# Altium project PCB_Project1.PrjPCB
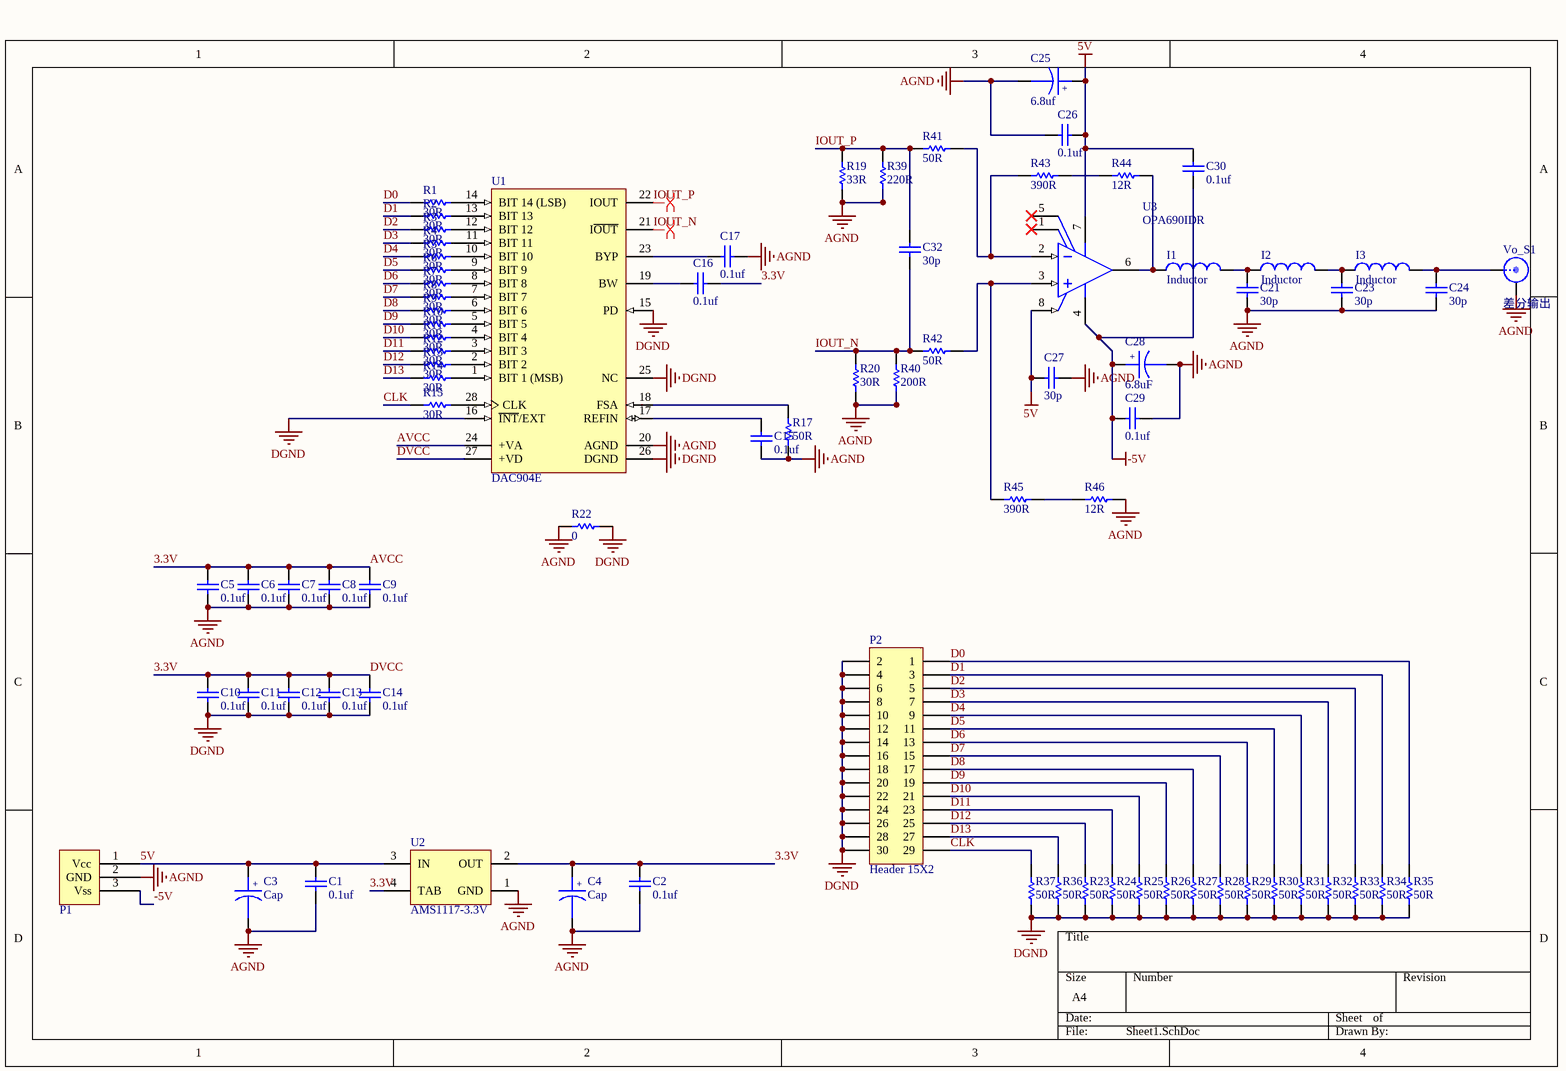
[diagram p0: Sheet1.SchDoc]
1 sheet, 78 parts. Net scope: global (net labels, ports and power ports of the same name join across sheets).
Board files: PCB1.PcbDoc, PCB2.PcbDoc

## Sheet Sheet1.SchDoc
size A4

### Parts
C1  0.1uf  [0805]
C2  0.1uf  [0805]
C3  Cap  [7343C-TYPE_D]
C4  Cap  [7343C-TYPE_D]
C5  0.1uf  [0603C]
C6  0.1uf  [0603C]
C7  0.1uf  [0603C]
C8  0.1uf  [0603C]
C9  0.1uf  [0603C]
C10  0.1uf  [0603C]
C11  0.1uf  [0603C]
C12  0.1uf  [0603C]
C13  0.1uf  [0603C]
C14  0.1uf  [0603C]
C15  0.1uf  [0603C]
C16  0.1uf  [0603C]
C17  0.1uf  [0603C]
C21  30p  [0603C]
C23  30p  [0603C]
C24  30p  [0603C]
C25  6.8uf  [3216C-TYPE_A]
C26  0.1uf  [0603C]
C27  30p  [0603C]
C28  6.8uF  [3216C-TYPE_A]
C29  0.1uf  [0603C]
C30  0.1uf  [0603C]
C32  30p  [0603C]
I1  Inductor  [0603C]
I2  Inductor  [0603C]
I3  Inductor  [0603C]
P1  XH2.54-3p  [XH2.54-3p]  (value not drawn)
P2  Header 15X2  [HDR2X15]
R1  30R  [0603R]
R2  30R  [0603R]
R3  30R  [0603R]
R4  30R  [0603R]
R5  30R  [0603R]
R6  30R  [0603R]
R7  30R  [0603R]
R8  30R  [0603R]
R9  30R  [0603R]
R10  30R  [0603R]
R11  30R  [0603R]
R12  30R  [0603R]
R13  30R  [0603R]
R14  30R  [0603R]
R15  30R  [0603R]
R17  50R  [0603R]
R19  33R  [0603R]
R20  30R  [0603R]
R22  0  [0603R]
R23  50R  [0603R]
R24  50R  [0603R]
R25  50R  [0603R]
R26  50R  [0603R]
R27  50R  [0603R]
R28  50R  [0603R]
R29  50R  [0603R]
R30  50R  [0603R]
R31  50R  [0603R]
R32  50R  [0603R]
R33  50R  [0603R]
R34  50R  [0603R]
R35  50R  [0603R]
R36  50R  [0603R]
R37  50R  [0603R]
R39  220R  [0603R]
R40  200R  [0603R]
R41  50R  [0603R]
R42  50R  [0603R]
R43  390R  [0603R]
R44  12R  [0603R]
R45  390R  [0603R]
R46  12R  [0603R]
U1  DAC904E  [TI-PW28_N]
U2  AMS1117-3.3V  [SOT-223]
U3  OPA690IDR  [TI-D8_M]
Vo_S1  差分输出  [SMA-LYING]

### Nets
5V: C1.2 C3.1 C25.1 C26.1 C27.1 C30.2 P1.1(Vcc) U2.3(IN) U3.7(VS+) U3.8(~{DIS})
-5V: C28.1 C29.1 C30.1 P1.3(Vss) U3.4(VS-)
AGND: C1.1 C2.1 C3.2 C4.2 C5.1 C6.1 C7.1 C8.1 C9.1 C15.1 C17.2 C21.2 C23.1 C24.1 C25.2 C26.2 C27.2 C28.2 C29.2 P1.2(GND) R17.1 R19.1 R20.1 R22.1 R39.1 R40.1 R46.2 U1.20(AGND) U2.1(GND) Vo_S1.1
DGND: C10.1 C11.1 C12.1 C13.1 C14.1 P2.2 P2.4 P2.6 P2.8 P2.10 P2.12 P2.14 P2.16 P2.18 P2.20 P2.22 P2.24 P2.26 P2.28 P2.30 R22.2 R23.2 R24.2 R25.2 R26.2 R27.2 R28.2 R29.2 R30.2 R31.2 R32.2 R33.2 R34.2 R35.2 R36.1 R37.1 U1.15(PD) U1.16(~{INT}/EXT) U1.25(NC) U1.26(DGND)
3.3V: C2.2 C4.1 C5.2 C6.2 C7.2 C8.2 C9.2 C10.2 C11.2 C12.2 C13.2 C14.2 C16.2 U1.24(+VA) U1.27(+VD) U2.2(OUT) U2.4(TAB)  [also labelled AVCC, DVCC]
CLK: P2.29 R15.1 R37.2
D0: P2.1 R1.1 R35.1
D1: P2.3 R2.1 R34.1
D2: P2.5 R3.1 R33.1
D3: P2.7 R4.1 R32.1
D4: P2.9 R5.1 R31.1
D5: P2.11 R6.1 R30.1
D6: P2.13 R7.1 R29.1
D7: P2.15 R8.1 R28.1
D8: P2.17 R9.1 R27.1
D9: P2.19 R10.1 R26.1
D10: P2.21 R11.1 R25.1
D11: P2.23 R12.1 R24.1
D12: P2.25 R13.1 R23.1
D13: P2.27 R14.1 R36.2
IOUT_N: C32.1 R20.2 R40.2 R42.1 U1.21(I~{OUT})
IOUT_P: C32.2 R19.2 R39.2 R41.1 U1.22(IOUT)
NetC15_2: C15.2 U1.17(REFIN)
NetC16_1: C16.1 U1.19(BW)
NetC17_1: C17.1 U1.23(BYP)
NetC21_1: C21.1 I1.2 I2.1
NetC23_2: C23.2 I2.2 I3.1
NetC24_2: C24.2 I3.2 Vo_S1.0
NetI1_1: I1.1 R44.2 U3.6(OUT)
NetR1_2: R1.2 U1.14(BIT_14_(LSB))
NetR2_2: R2.2 U1.13(BIT_13)
NetR3_2: R3.2 U1.12(BIT_12)
NetR4_2: R4.2 U1.11(BIT_11)
NetR5_2: R5.2 U1.10(BIT_10)
NetR6_2: R6.2 U1.9(BIT_9)
NetR7_2: R7.2 U1.8(BIT_8)
NetR8_2: R8.2 U1.7(BIT_7)
NetR9_2: R9.2 U1.6(BIT_6)
NetR10_2: R10.2 U1.5(BIT_5)
NetR11_2: R11.2 U1.4(BIT_4)
NetR12_2: R12.2 U1.3(BIT_3)
NetR13_2: R13.2 U1.2(BIT_2)
NetR14_2: R14.2 U1.1(BIT_1_(MSB))
NetR15_2: R15.2 U1.28(CLK)
NetR17_2: R17.2 U1.18(FSA)
NetR41_2: R41.2 R43.1 U3.2(IN-)
NetR42_2: R42.2 R45.1 U3.3(IN+)
NetR43_2: R43.2 R44.1
NetR45_2: R45.2 R46.1

Not connected (* = marked no-connect by the designer): U3 1(NC)* 5(NC)*

### Layout directives
differential pair: IOUT_N, IOUT_P

### Notes on the sheet
- (in symbol Tantalium Cap) +
- (in symbol Cap) +

### Library data of the parts
C1 C2 C5-C17 C21 C23 C24 C26 C27 C29 C30 C32 = Cap
C3 C4 C25 C28 = Tantalium Cap
P2 = Header 15X2: Header, 15-Pin, Dual row; LatestRevisionDate: 17-Jul-2002; LatestRevisionNote: Re-released for DXP Platform.; Publisher: Altium Limited
R1-R15 R17 R19 R20 R22-R37 R39-R46 = Res
U1 = DAC904E: 14-Bit, 165 MSPS SpeedPlus(TM) DAC Scalable Current Outputs between 2 to 20 mA, -40 to 85 degC, 28-pin SOP (PW28), Green (RoHS & no Sb/Br); Manufacturer: Texas Instruments; DAC Channels: 1; Interface: Parallel CMOS; Power Consumption(Typ)(mW): 170; Resolution(Bits): 14; Settling Time(us): 0.03; SFDR(dB): 76; SubFamily: High Speed DAC (>10MSPS); DatasheetVersion: SBAS095C; PackageVersion: 4040064-7/G, 02/2011; PackageReference: PW28; PackageDescription: 28-Pin Plastic Small Outline, Body 9.7 x 4.4 mm, Pitch 0.65 mm; Eco-Plan: Green (RoHS & no Sb/Br); Mounting Technology: Surface Mount; Code_JEDEC: MO-153; PartNumber: DAC904E; ComponentLink1Description: Manufacturer URL; ComponentLink1URL: http://www.ti.com/; ComponentLink2Description: Datasheet; ComponentLink2URL: http://www.ti.com/general/docs/lit/getliterature.tsp?genericPartNumber=DAC904&fileType=pdf; ComponentLink3Description: Package Specification; ComponentLink3URL: http://www.ti.com/litv/pdf/mpds364
U3 = OPA690IDR: Wideband, Voltage Feedback Operational Amplifier with Disable, 5 to 12 V, -40 to 85 degC, 8-pin SOIC (D8), Green (RoHS & no Sb/Br); Manufacturer: Texas Instruments; 2nd Harmonic(dBc): 77; 3rd Harmonic(dBc): 81; @ MHz: 5; Acl, min stable gain(V/V): 1; BW @ Acl(MHz): 500; Diff Gain(%): 0.06; Diff Phase(deg): 0.03; Iib(Max)(nA): 11000; Io(Typ)(mA): 190; Iq per channel(Max)(mA): 6.2; Settling Time (0.1%)(Typ)(ns): 8; Slew Rate(Typ)(V/us): 1800; Sub Family: High Output Current Amplifier (>=50mA), High Speed Amplifier (>=50MHz); THD (Fc is 1 MHz)(Typ)(dB): -80; Vio(Max)(mV): 4.5; Vn at Flatband(Typ)(nV/rtHz): 5.5; Vs(Max)(V): 12; DatasheetVersion: SBOS223F; PackageVersion: 4040047-3/M, 06/2011; PackageReference: D8; PackageDescription: 8-Pin Plastic Small Outline, Body 4.9 x 3.9 mm, Pitch 1.27 mm; Eco-Plan: Green (RoHS & no Sb/Br); Number of Channels: 1; Vs(Min)(V): 5; Mounting Technology: Surface Mount; Code_JEDEC: MS-012; PartNumber: OPA690IDR; ComponentLink1Description: Manufacturer URL; ComponentLink1URL: http://www.ti.com/; ComponentLink2Description: Datasheet; ComponentLink2URL: http://www.ti.com/general/docs/lit/getliterature.tsp?genericPartNumber=OPA690&fileType=pdf; ComponentLink3Description: Package Specification; ComponentLink3URL: http://www.ti.com/litv/pdf/msoi002j
Vo_S1 = SMA